# Altium project 8500_anger.PrjPCB
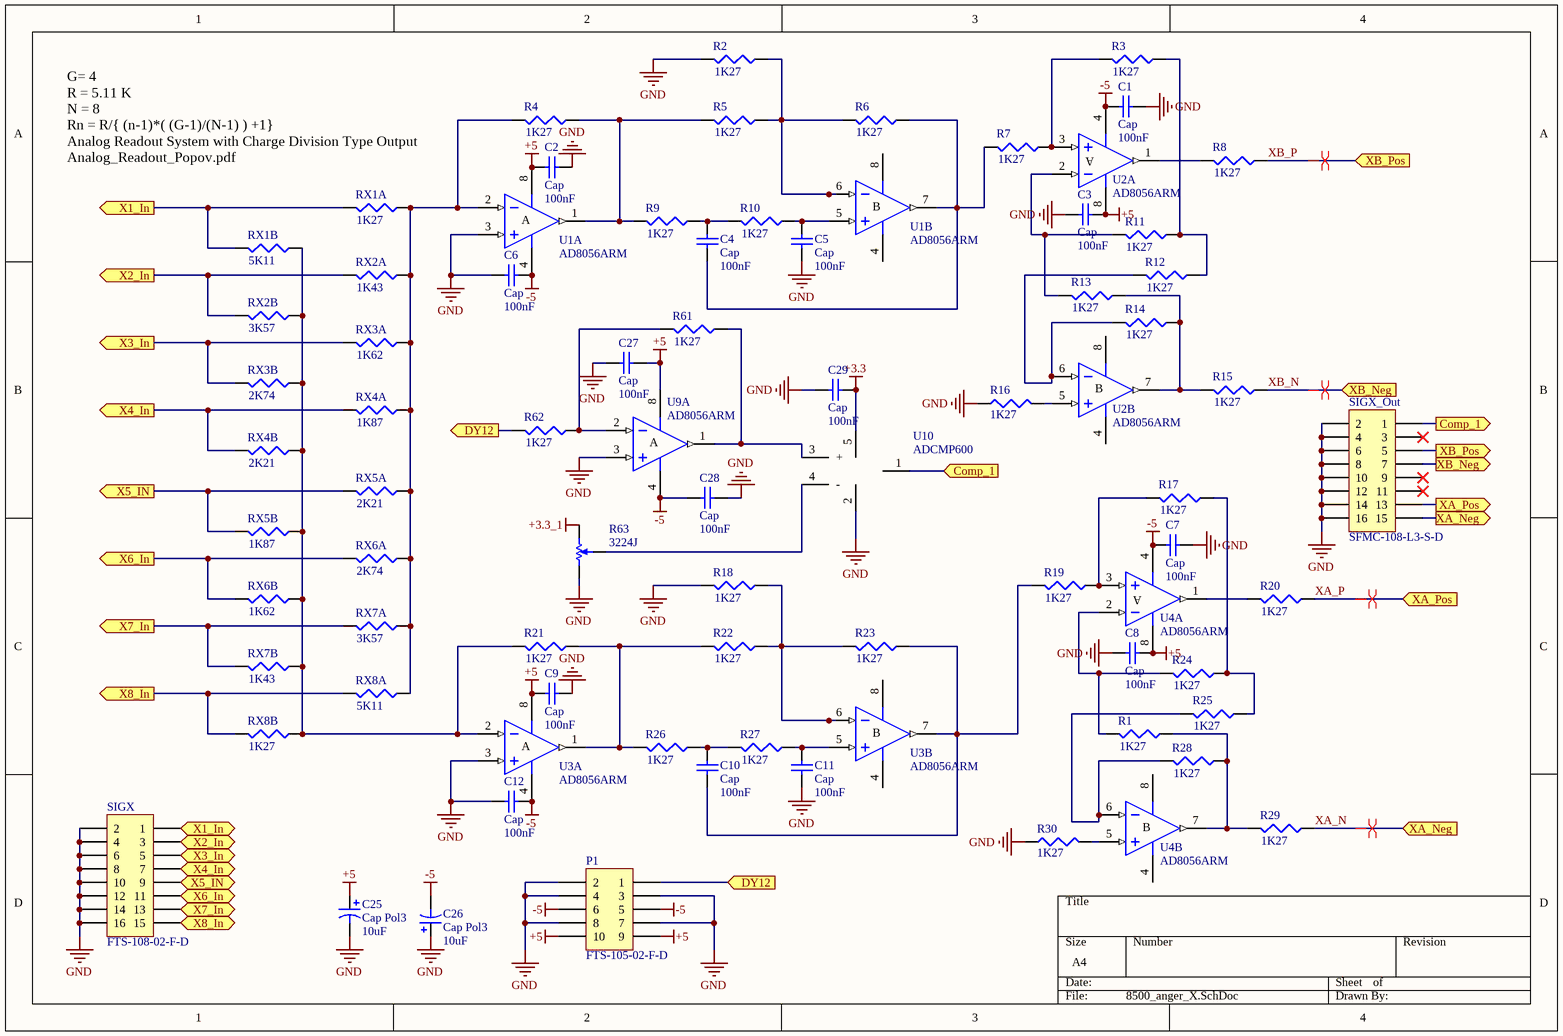
[diagram p0: 8500_anger_X.SchDoc]
2 sheets, 147 parts. Net scope: flat (ports and power ports of the same name join across sheets).
Board file: 8500_anger.PcbDoc
Sheets:
  8500_anger_X.SchDoc
  8500_anger_Y.SchDoc

## Sheet 8500_anger_X.SchDoc
size A4

### Parts
C1  Cap  value 100nF  [J1-0603]
C2  Cap  value 100nF  [J1-0603]
C3  Cap  value 100nF  [J1-0603]
C4  Cap  value 100nF  [J1-0603]
C5  Cap  value 100nF  [J1-0603]
C6  Cap  value 100nF  [J1-0603]
C7  Cap  value 100nF  [J1-0603]
C8  Cap  value 100nF  [J1-0603]
C9  Cap  value 100nF  [J1-0603]
C10  Cap  value 100nF  [J1-0603]
C11  Cap  value 100nF  [J1-0603]
C12  Cap  value 100nF  [J1-0603]
C25  Cap Pol3  value 10uF  [C0805]
C26  Cap Pol3  value 10uF  [C0805]
C27  Cap  value 100nF  [J1-0603]
C28  Cap  value 100nF  [J1-0603]
C29  Cap  value 100nF  [J1-0603]
P1  FTS-105-02-F-D  [MHDR2X5]
R1  value 1K27  [0402]  (hidden comment: Res3)
R2  value 1K27  [0402]  (hidden comment: Res3)
R3  value 1K27  [0402]  (hidden comment: Res3)
R4  value 1K27  [0402]  (hidden comment: Res3)
R5  value 1K27  [0402]  (hidden comment: Res3)
R6  value 1K27  [0402]  (hidden comment: Res3)
R7  value 1K27  [0402]  (hidden comment: Res3)
R8  value 1K27  [0402]  (hidden comment: Res3)
R9  value 1K27  [0402]  (hidden comment: Res3)
R10  value 1K27  [0402]  (hidden comment: Res3)
R11  value 1K27  [0402]  (hidden comment: Res3)
R12  value 1K27  [0402]  (hidden comment: Res3)
R13  value 1K27  [0402]  (hidden comment: Res3)
R14  value 1K27  [0402]  (hidden comment: Res3)
R15  value 1K27  [0402]  (hidden comment: Res3)
R16  value 1K27  [0402]  (hidden comment: Res3)
R17  value 1K27  [0402]  (hidden comment: Res3)
R18  value 1K27  [0402]  (hidden comment: Res3)
R19  value 1K27  [0402]  (hidden comment: Res3)
R20  value 1K27  [0402]  (hidden comment: Res3)
R21  value 1K27  [0402]  (hidden comment: Res3)
R22  value 1K27  [0402]  (hidden comment: Res3)
R23  value 1K27  [0402]  (hidden comment: Res3)
R24  value 1K27  [0402]  (hidden comment: Res3)
R25  value 1K27  [0402]  (hidden comment: Res3)
R26  value 1K27  [0402]  (hidden comment: Res3)
R27  value 1K27  [0402]  (hidden comment: Res3)
R28  value 1K27  [0402]  (hidden comment: Res3)
R29  value 1K27  [0402]  (hidden comment: Res3)
R30  value 1K27  [0402]  (hidden comment: Res3)
R61  value 1K27  [0402]  (hidden comment: Res3)
R62  value 1K27  [0402]  (hidden comment: Res3)
R63  3224J  [POT4MM-2]
RX1A  value 1K27  [0402]  (hidden comment: Res3)
RX1B  value 5K11  [0402]  (hidden comment: Res3)
RX2A  value 1K43  [0402]  (hidden comment: Res3)
RX2B  value 3K57  [0402]  (hidden comment: Res3)
RX3A  value 1K62  [0402]  (hidden comment: Res3)
RX3B  value 2K74  [0402]  (hidden comment: Res3)
RX4A  value 1K87  [0402]  (hidden comment: Res3)
RX4B  value 2K21  [0402]  (hidden comment: Res3)
RX5A  value 2K21  [0402]  (hidden comment: Res3)
RX5B  value 1K87  [0402]  (hidden comment: Res3)
RX6A  value 2K74  [0402]  (hidden comment: Res3)
RX6B  value 1K62  [0402]  (hidden comment: Res3)
RX7A  value 3K57  [0402]  (hidden comment: Res3)
RX7B  value 1K43  [0402]  (hidden comment: Res3)
RX8A  value 5K11  [0402]  (hidden comment: Res3)
RX8B  value 1K27  [0402]  (hidden comment: Res3)
SIGX  FTS-108-02-F-D  [MHDR2X8]
SIGX_Out  SFMC-108-L3-S-D  [MHDR2X8]
U1  AD8056ARM  [RM-8]  (parts A,B of 2)
U2  AD8056ARM  [RM-8]  (parts A,B of 2)
U3  AD8056ARM  [RM-8]  (parts A,B of 2)
U4  AD8056ARM  [RM-8]  (parts A,B of 2)
U9  AD8056ARM  [RM-8]  (part A of 2)
U10  ADCMP600  [SOT23-5_N]

### Ports
Comp_1 (in), Comp_1 (out), DY12 (in), DY12 (out), X1_In (in), X1_In (out), X2_In (in), X2_In (out), X3_In (in), X3_In (out), X4_In (in), X4_In (out), X5_IN (in), X5_IN (out), X6_In (in), X6_In (out), X7_In (in), X7_In (out), X8_In (in), X8_In (out), XA_Neg (in), XA_Neg (out), XA_Pos (in), XA_Pos (out), XB_Neg (in), XB_Neg (out), XB_Pos (in), XB_Pos (out)

### Nets
+3.3: C29.2 U10.5
+3.3_1: R63.CW(+)
+5: C2.1 C3.1 C8.1 C9.1 C25.1 C27.2 P1.9 P1.10 U1.8(V+) U2.8(V+) U3.8(V+) U4.8(V+) U9.8(V+)
-5: C1.1 C6.2 C7.1 C12.2 C26.2 C28.1 P1.5 P1.6 U1.4(V-) U2.4(V-) U3.4(V-) U4.4(V-) U9.4(V-)
GND: C1.2 C2.2 C3.2 C5.2 C6.1 C7.2 C8.2 C9.2 C11.2 C12.1 C25.2 C26.1 C27.1 C28.2 C29.1 P1.2 P1.3 P1.4 P1.7 P1.8 R2.2 R16.1 R18.2 R30.1 R63.CCW(-) SIGX.2 SIGX.4 SIGX.6 SIGX.8 SIGX.10 SIGX.12 SIGX.14 SIGX.16 SIGX_Out.2 SIGX_Out.4 SIGX_Out.6 SIGX_Out.8 SIGX_Out.10 SIGX_Out.12 SIGX_Out.14 SIGX_Out.16 U1.3(IN+) U3.3(IN+) U9.3(IN+) U10.2
XA_N: R29.1 SIGX_Out.15 ; port XA_Neg
XA_P: R20.1 SIGX_Out.13 ; port XA_Pos
XB_N: R15.1 SIGX_Out.7 ; port XB_Neg
XB_P: R8.1 SIGX_Out.5 ; port XB_Pos
NetC4_1: C4.1 R9.1 R10.2
NetC4_2: C4.2 R6.1 R7.2 U1.7(OUT)
NetC5_1: C5.1 R10.1 U1.5(IN+)
NetC10_1: C10.1 R26.1 R27.2
NetC10_2: C10.2 R19.2 R23.1 U3.7(OUT)
NetC11_1: C11.1 R27.1 U3.5(IN+)
NetP1_1: P1.1 R62.2 ; port DY12
NetR1_1: R1.1 R28.1 R29.2 U4.7(OUT)
NetR1_2: R1.2 R24.2 U4.2(IN-)
NetR2_1: R2.1 R5.1 R6.2 U1.6(IN-)
NetR3_1: R3.1 R11.1 R12.1
NetR3_2: R3.2 R7.1 U2.3(IN+)
NetR4_1: R4.1 R5.2 R9.2 U1.1(OUT)
NetR4_2: R4.2 RX1A.1 RX2A.1 RX3A.1 RX4A.1 RX5A.1 RX6A.1 RX7A.1 RX8A.1 U1.2(IN-)
NetR8_2: R8.2 U2.1(OUT)
NetR11_2: R11.2 R13.2 U2.2(IN-)
NetR12_2: R12.2 R14.2 U2.6(IN-)
NetR13_1: R13.1 R14.1 R15.2 U2.7(OUT)
NetR16_2: R16.2 U2.5(IN+)
NetR17_1: R17.1 R24.1 R25.1
NetR17_2: R17.2 R19.1 U4.3(IN+)
NetR18_1: R18.1 R22.1 R23.2 U3.6(IN-)
NetR20_2: R20.2 U4.1(OUT)
NetR21_1: R21.1 R22.2 R26.2 U3.1(OUT)
NetR21_2: R21.2 RX1B.1 RX2B.1 RX3B.1 RX4B.1 RX5B.1 RX6B.1 RX7B.1 RX8B.1 U3.2(IN-)
NetR25_2: R25.2 R28.2 U4.6(IN-)
NetR30_2: R30.2 U4.5(IN+)
NetR61_1: R61.1 U9.1(OUT) U10.3(+)
NetR61_2: R61.2 R62.1 U9.2(IN-)
NetR63_W: R63.W U10.4(-)
NetRX1A_2: RX1A.2 RX1B.2 SIGX.1 ; port X1_In
NetRX2A_2: RX2A.2 RX2B.2 SIGX.3 ; port X2_In
NetRX3A_2: RX3A.2 RX3B.2 SIGX.5 ; port X3_In
NetRX4A_2: RX4A.2 RX4B.2 SIGX.7 ; port X4_In
NetRX5A_2: RX5A.2 RX5B.2 SIGX.9 ; port X5_IN
NetRX6A_2: RX6A.2 RX6B.2 SIGX.11 ; port X6_In
NetRX7A_2: RX7A.2 RX7B.2 SIGX.13 ; port X7_In
NetRX8A_2: RX8A.2 RX8B.2 SIGX.15 ; port X8_In
NetSIGX_Out_1: SIGX_Out.1 U10.1 ; port Comp_1

Not connected (* = marked no-connect by the designer): SIGX_Out 3* 9* 11*

### Layout directives
differential pair: XA_N, XA_P, XB_N, XB_P

### Notes on the sheet
- (near RX1A) G= 4
  R = 5.11 K
  N = 8
  Rn = R/{ (n-1)*( (G-1)/(N-1) ) +1}
  Analog Readout System with Charge Division Type Output
  Analog_Readout_Popov.pdf
- (in symbol AD8056ARM, part A) A
- (in symbol AD8056ARM, part B) B

### Library data of the parts
C1-C12 C27-C29 = Cap: Capacitor; Published: 8-Jun-2000; LatestRevisionDate: 17-Jul-2002; LatestRevisionNote: Re-released for DXP Platform.; PackageReference: RAD-0.3; Publisher: Altium Limited; PackageDescription: Radial Cap, Thru-Hole; 2 Leads; 0.3 in Pin Spacing
C25 C26 = Cap Pol3: Polarized Capacitor (Surface Mount); Published: 8-Jun-2000; LatestRevisionDate: 29-May-2009; LatestRevisionNote: IPC-7351 Footprint Added.; PackageReference: C0805; Publisher: Altium Limited; PackageDescription: Chip Capacitor
R1-R30 R61 R62 RX1A RX1B RX2A RX2B RX3A RX3B RX4A RX4B RX5A RX5B RX6A RX6B RX7A RX7B RX8A RX8B = Res3: Resistor; Published: 8-Jun-2000; LatestRevisionDate: 29-May-2009; LatestRevisionNote: IPC-7351 Footprint Added.; PackageReference: J1-0603; Publisher: Altium Limited; PackageDescription: Chip Resistor
R63 = RPot SM: Square Trimming Potentiometer; Published: 17-Dec-2003; DatasheetVersion: Oct-2003; PackageReference: POT4MM-2; Publisher: Altium Limited; PackageDescription: Square Trimming Potentiometer; ComponentLink1Description: Manufacturer Link; ComponentLink1URL: http://bourns.com/2/search.html
SIGX SIGX_Out = FTR-108-01-D
U1-U4 U9 = AD8056ARM: Low Cost, 300MHz Voltage Feedback Amplifier; Published: 8-Jun-2000; LatestRevisionDate: 04-Mar-2005; LatestRevisionNote: Stylized 3D Model Added, PCB footprint pad width decreased.; DatasheetVersion: REV. 0 1997; PackageVersion: 2004; PackageReference: RM-8; Publisher: Altium Limited; PackageDescription: Shrink Small Outline, MSOP; 8 Leads; Body Width 3 mm; Pitch 0.65 mm; Code_JEDEC: MO-187-AA; ComponentLink1Description: Manufacturer Link; ComponentLink1URL: http://www.analog.com/en/prod/0,,759_786_AD8055%2C00.html; ComponentLink2Description: Datasheet; ComponentLink2URL: http://www.analog.com/UploadedFiles/Data_Sheets/40402558757264AD8055_6_i.pdf

## Sheet 8500_anger_Y.SchDoc
size A4
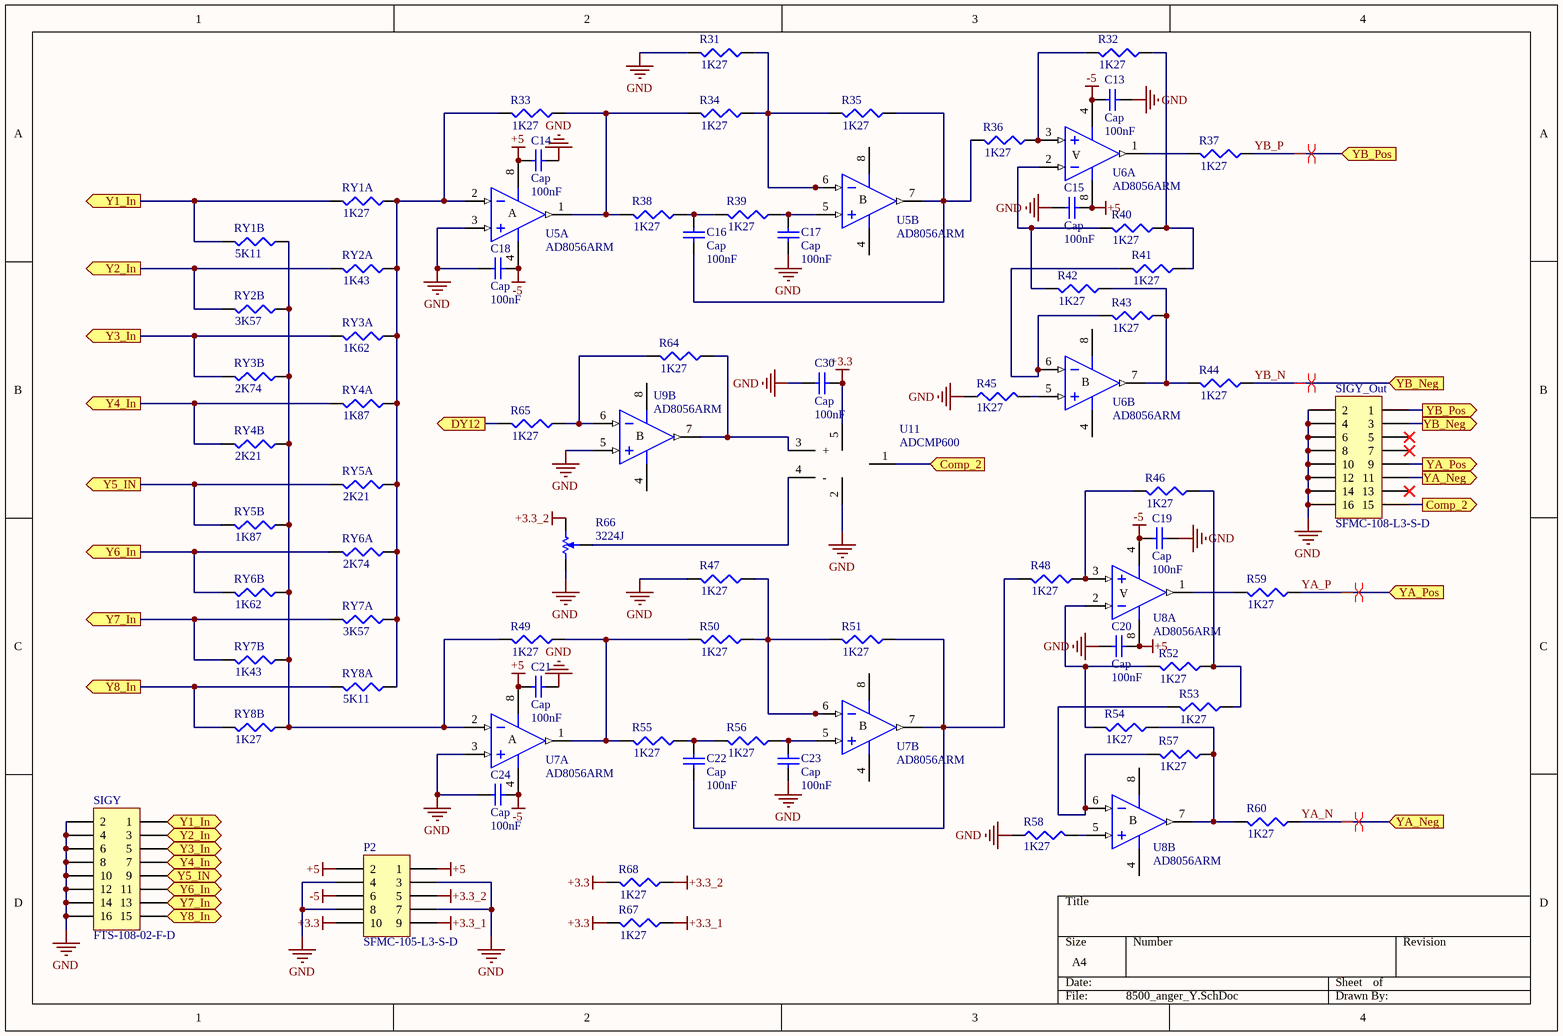
[diagram p1: 8500_anger_Y.SchDoc]

### Parts
C13  Cap  value 100nF  [J1-0603]
C14  Cap  value 100nF  [J1-0603]
C15  Cap  value 100nF  [J1-0603]
C16  Cap  value 100nF  [J1-0603]
C17  Cap  value 100nF  [J1-0603]
C18  Cap  value 100nF  [J1-0603]
C19  Cap  value 100nF  [J1-0603]
C20  Cap  value 100nF  [J1-0603]
C21  Cap  value 100nF  [J1-0603]
C22  Cap  value 100nF  [J1-0603]
C23  Cap  value 100nF  [J1-0603]
C24  Cap  value 100nF  [J1-0603]
C30  Cap  value 100nF  [J1-0603]
P2  SFMC-105-L3-S-D  [MHDR2X5]
R31  value 1K27  [0402]  (hidden comment: Res3)
R32  value 1K27  [0402]  (hidden comment: Res3)
R33  value 1K27  [0402]  (hidden comment: Res3)
R34  value 1K27  [0402]  (hidden comment: Res3)
R35  value 1K27  [0402]  (hidden comment: Res3)
R36  value 1K27  [0402]  (hidden comment: Res3)
R37  value 1K27  [0402]  (hidden comment: Res3)
R38  value 1K27  [0402]  (hidden comment: Res3)
R39  value 1K27  [0402]  (hidden comment: Res3)
R40  value 1K27  [0402]  (hidden comment: Res3)
R41  value 1K27  [0402]  (hidden comment: Res3)
R42  value 1K27  [0402]  (hidden comment: Res3)
R43  value 1K27  [0402]  (hidden comment: Res3)
R44  value 1K27  [0402]  (hidden comment: Res3)
R45  value 1K27  [0402]  (hidden comment: Res3)
R46  value 1K27  [0402]  (hidden comment: Res3)
R47  value 1K27  [0402]  (hidden comment: Res3)
R48  value 1K27  [0402]  (hidden comment: Res3)
R49  value 1K27  [0402]  (hidden comment: Res3)
R50  value 1K27  [0402]  (hidden comment: Res3)
R51  value 1K27  [0402]  (hidden comment: Res3)
R52  value 1K27  [0402]  (hidden comment: Res3)
R53  value 1K27  [0402]  (hidden comment: Res3)
R54  value 1K27  [0402]  (hidden comment: Res3)
R55  value 1K27  [0402]  (hidden comment: Res3)
R56  value 1K27  [0402]  (hidden comment: Res3)
R57  value 1K27  [0402]  (hidden comment: Res3)
R58  value 1K27  [0402]  (hidden comment: Res3)
R59  value 1K27  [0402]  (hidden comment: Res3)
R60  value 1K27  [0402]  (hidden comment: Res3)
R64  value 1K27  [0402]  (hidden comment: Res3)
R65  value 1K27  [0402]  (hidden comment: Res3)
R66  3224J  [POT4MM-2]
R67  value 1K27  [0402]  (hidden comment: Res3)
R68  value 1K27  [0402]  (hidden comment: Res3)
RY1A  value 1K27  [0402]  (hidden comment: Res3)
RY1B  value 5K11  [0402]  (hidden comment: Res3)
RY2A  value 1K43  [0402]  (hidden comment: Res3)
RY2B  value 3K57  [0402]  (hidden comment: Res3)
RY3A  value 1K62  [0402]  (hidden comment: Res3)
RY3B  value 2K74  [0402]  (hidden comment: Res3)
RY4A  value 1K87  [0402]  (hidden comment: Res3)
RY4B  value 2K21  [0402]  (hidden comment: Res3)
RY5A  value 2K21  [0402]  (hidden comment: Res3)
RY5B  value 1K87  [0402]  (hidden comment: Res3)
RY6A  value 2K74  [0402]  (hidden comment: Res3)
RY6B  value 1K62  [0402]  (hidden comment: Res3)
RY7A  value 3K57  [0402]  (hidden comment: Res3)
RY7B  value 1K43  [0402]  (hidden comment: Res3)
RY8A  value 5K11  [0402]  (hidden comment: Res3)
RY8B  value 1K27  [0402]  (hidden comment: Res3)
SIGY  FTS-108-02-F-D  [MHDR2X8]
SIGY_Out  SFMC-108-L3-S-D  [MHDR2X8]
U5  AD8056ARM  [RM-8]  (parts A,B of 2)
U6  AD8056ARM  [RM-8]  (parts A,B of 2)
U7  AD8056ARM  [RM-8]  (parts A,B of 2)
U8  AD8056ARM  [RM-8]  (parts A,B of 2)
U9  AD8056ARM  [RM-8]  (part B of 2)
U11  ADCMP600  [SOT23-5_N]

### Ports
Comp_2 (in), Comp_2 (out), DY12 (out), Y1_In (in), Y1_In (out), Y2_In (in), Y2_In (out), Y3_In (in), Y3_In (out), Y4_In (in), Y4_In (out), Y5_IN (in), Y5_IN (out), Y6_In (in), Y6_In (out), Y7_In (in), Y7_In (out), Y8_In (in), Y8_In (out), YA_Neg (in), YA_Neg (out), YA_Pos (in), YA_Pos (out), YB_Neg (in), YB_Neg (out), YB_Pos (in), YB_Pos (out)

### Nets
+3.3: C30.2 P2.10 R67.2 R68.2 U11.5
+3.3_1: P2.9 R67.1
+3.3_2: P2.5 R66.CW(+) R68.1
+5: C14.1 C15.1 C20.1 C21.1 P2.1 P2.2 U5.8(V+) U6.8(V+) U7.8(V+) U8.8(V+) U9.8(V+)
-5: C13.1 C18.2 C19.1 C24.2 P2.6 U5.4(V-) U6.4(V-) U7.4(V-) U8.4(V-) U9.4(V-)
GND: C13.2 C14.2 C15.2 C17.2 C18.1 C19.2 C20.2 C21.2 C23.2 C24.1 C30.1 P2.3 P2.4 P2.7 P2.8 R31.2 R45.1 R47.2 R58.1 R66.CCW(-) SIGY.2 SIGY.4 SIGY.6 SIGY.8 SIGY.10 SIGY.12 SIGY.14 SIGY.16 SIGY_Out.2 SIGY_Out.4 SIGY_Out.6 SIGY_Out.8 SIGY_Out.10 SIGY_Out.12 SIGY_Out.14 SIGY_Out.16 U5.3(IN+) U7.3(IN+) U9.5(IN+) U11.2
YA_N: R60.1 SIGY_Out.11 ; port YA_Neg
YA_P: R59.1 SIGY_Out.9 ; port YA_Pos
YB_N: R44.1 SIGY_Out.3 ; port YB_Neg
YB_P: R37.1 SIGY_Out.1 ; port YB_Pos
NetC16_1: C16.1 R38.1 R39.2
NetC16_2: C16.2 R35.1 R36.2 U5.7(OUT)
NetC17_1: C17.1 R39.1 U5.5(IN+)
NetC22_1: C22.1 R55.1 R56.2
NetC22_2: C22.2 R48.2 R51.1 U7.7(OUT)
NetC23_1: C23.1 R56.1 U7.5(IN+)
NetP1_1: R65.2 ; port DY12
NetR31_1: R31.1 R34.1 R35.2 U5.6(IN-)
NetR32_1: R32.1 R40.1 R41.1
NetR32_2: R32.2 R36.1 U6.3(IN+)
NetR33_1: R33.1 R34.2 R38.2 U5.1(OUT)
NetR33_2: R33.2 RY1A.1 RY2A.1 RY3A.1 RY4A.1 RY5A.1 RY6A.1 RY7A.1 RY8A.1 U5.2(IN-)
NetR37_2: R37.2 U6.1(OUT)
NetR40_2: R40.2 R42.2 U6.2(IN-)
NetR41_2: R41.2 R43.2 U6.6(IN-)
NetR42_1: R42.1 R43.1 R44.2 U6.7(OUT)
NetR45_2: R45.2 U6.5(IN+)
NetR46_1: R46.1 R52.1 R53.1
NetR46_2: R46.2 R48.1 U8.3(IN+)
NetR47_1: R47.1 R50.1 R51.2 U7.6(IN-)
NetR49_1: R49.1 R50.2 R55.2 U7.1(OUT)
NetR49_2: R49.2 RY1B.1 RY2B.1 RY3B.1 RY4B.1 RY5B.1 RY6B.1 RY7B.1 RY8B.1 U7.2(IN-)
NetR52_2: R52.2 R54.2 U8.2(IN-)
NetR53_2: R53.2 R57.2 U8.6(IN-)
NetR54_1: R54.1 R57.1 R60.2 U8.7(OUT)
NetR58_2: R58.2 U8.5(IN+)
NetR59_2: R59.2 U8.1(OUT)
NetR64_1: R64.1 U9.7(OUT) U11.3(+)
NetR64_2: R64.2 R65.1 U9.6(IN-)
NetR66_W: R66.W U11.4(-)
NetRY1A_2: RY1A.2 RY1B.2 SIGY.1 ; port Y1_In
NetRY2A_2: RY2A.2 RY2B.2 SIGY.3 ; port Y2_In
NetRY3A_2: RY3A.2 RY3B.2 SIGY.5 ; port Y3_In
NetRY4A_2: RY4A.2 RY4B.2 SIGY.7 ; port Y4_In
NetRY5A_2: RY5A.2 RY5B.2 SIGY.9 ; port Y5_IN
NetRY6A_2: RY6A.2 RY6B.2 SIGY.11 ; port Y6_In
NetRY7A_2: RY7A.2 RY7B.2 SIGY.13 ; port Y7_In
NetRY8A_2: RY8A.2 RY8B.2 SIGY.15 ; port Y8_In
NetSIGY_Out_15: SIGY_Out.15 U11.1 ; port Comp_2

Not connected (* = marked no-connect by the designer): SIGY_Out 5* 7* 13*

### Layout directives
differential pair: YA_N, YA_P, YB_N, YB_P

### Notes on the sheet
- (in symbol AD8056ARM, part A) A
- (in symbol AD8056ARM, part B) B

### Library data of the parts
C13-C24 C30 = Cap: Capacitor; Published: 8-Jun-2000; LatestRevisionDate: 17-Jul-2002; LatestRevisionNote: Re-released for DXP Platform.; PackageReference: RAD-0.3; Publisher: Altium Limited; PackageDescription: Radial Cap, Thru-Hole; 2 Leads; 0.3 in Pin Spacing
P2 = FTS-105-02-F-D
R31-R60 R64 R65 R67 R68 RY1A RY1B RY2A RY2B RY3A RY3B RY4A RY4B RY5A RY5B RY6A RY6B RY7A RY7B RY8A RY8B = Res3: Resistor; Published: 8-Jun-2000; LatestRevisionDate: 29-May-2009; LatestRevisionNote: IPC-7351 Footprint Added.; PackageReference: J1-0603; Publisher: Altium Limited; PackageDescription: Chip Resistor
R66 = RPot SM: Square Trimming Potentiometer; Published: 17-Dec-2003; DatasheetVersion: Oct-2003; PackageReference: POT4MM-2; Publisher: Altium Limited; PackageDescription: Square Trimming Potentiometer; ComponentLink1Description: Manufacturer Link; ComponentLink1URL: http://bourns.com/2/search.html
SIGY SIGY_Out = FTR-108-01-D
U5-U9 = AD8056ARM: as U1 on sheet 8500_anger_X; Published: 8-Jun-2000; LatestRevisionDate: 04-Mar-2005; LatestRevisionNote: Stylized 3D Model Added, PCB footprint pad width decreased.; DatasheetVersion: REV. 0 1997; PackageVersion: 2004; PackageReference: RM-8; Publisher: Altium Limited; PackageDescription: Shrink Small Outline, MSOP; 8 Leads; Body Width 3 mm; Pitch 0.65 mm; Code_JEDEC: MO-187-AA; ComponentLink1Description: Manufacturer Link; ComponentLink1URL: http://www.analog.com/en/prod/0,,759_786_AD8055%2C00.html; ComponentLink2Description: Datasheet; ComponentLink2URL: http://www.analog.com/UploadedFiles/Data_Sheets/40402558757264AD8055_6_i.pdf

## Nets that join several sheets
+3.3: 8500_anger_X (C29.2 U10.5), 8500_anger_Y (5 pins)
+3.3_1: 8500_anger_X (R63.CW), 8500_anger_Y (P2.9 R67.1)
+5: 8500_anger_X (13 pins), 8500_anger_Y (11 pins)
-5: 8500_anger_X (13 pins), 8500_anger_Y (10 pins)
GND: 8500_anger_X (45 pins), 8500_anger_Y (40 pins)
NetP1_1: 8500_anger_X (P1.1 R62.2), 8500_anger_Y (R65.2)